# Altium schematic sheet misc.SchDoc
size A4
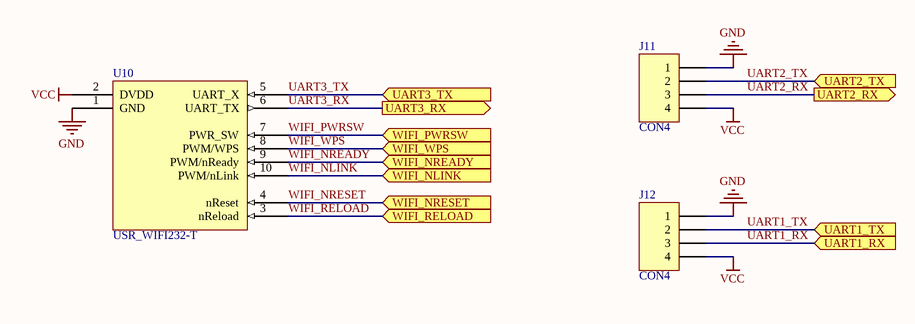
[diagram p0: misc.SchDoc]

## Parts
J11  CON4  [HDR1X4]
J12  CON4  [HDR1X4]
U10  USR_WIFI232-T

## Ports
UART1_RX (in), UART1_TX (in), UART2_RX (out), UART2_TX (in), UART3_RX (out), UART3_TX (in), WIFI_NLINK (in), WIFI_NREADY (in), WIFI_NRESET (in), WIFI_PWRSW (in), WIFI_RELOAD (in), WIFI_WPS (in)

## Nets
GND: J11.1 J12.1 U10.1(GND)
VCC: J11.4 J12.4 U10.2(DVDD)
UART1_RX: J12.3 ; port UART1_RX
UART1_TX: J12.2 ; port UART1_TX
UART2_RX: J11.3 ; port UART2_RX
UART2_TX: J11.2 ; port UART2_TX
UART3_RX: U10.6(UART_TX) ; port UART3_RX
UART3_TX: U10.5(UART_X) ; port UART3_TX
WIFI_NLINK: U10.10(PWM/nLink) ; port WIFI_NLINK
WIFI_NREADY: U10.9(PWM/nReady) ; port WIFI_NREADY
WIFI_NRESET: U10.4(nReset) ; port WIFI_NRESET
WIFI_PWRSW: U10.7(PWR_SW) ; port WIFI_PWRSW
WIFI_RELOAD: U10.3(nReload) ; port WIFI_RELOAD
WIFI_WPS: U10.8(PWM/WPS) ; port WIFI_WPS

## Library data of the parts
J11 J12 = Header 4: Header, 4-Pin; LatestRevisionDate: 17-Jul-2002; LatestRevisionNote: Re-released for DXP Platform.; Publisher: Altium Limited